# Altium schematic sheet Motor-E2.SchDoc: Motor-E2
size Letter; DocumentNumber: 3; SheetNumber: 9; SheetTotal: 11
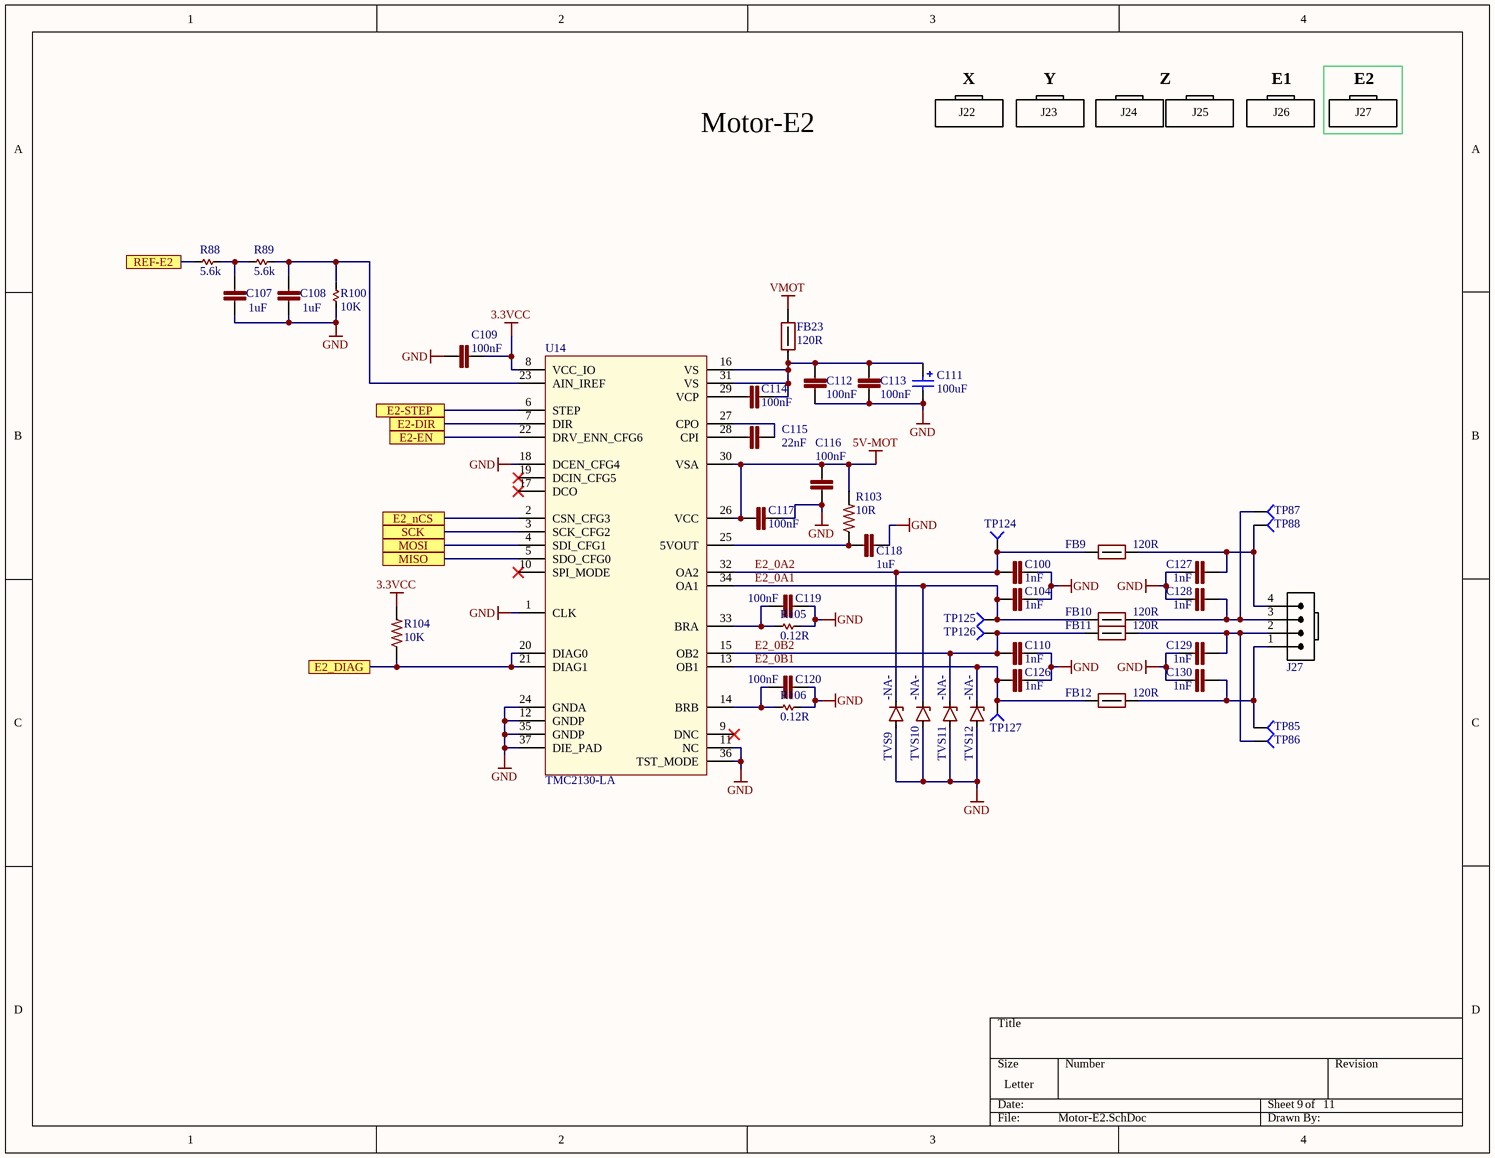
[diagram p0: Motor-E2.SchDoc]

## Parts
C100  1nF  [C0402]
C104  1nF  [C0402]
C107  1uF  [C0402]
C108  1uF  [C0402]
C109  100nF  [C0402]
C110  1nF  [C0402]
C111  value 100uF  [CAP-ELEC-063063077]  (hidden comment: UWT1V101MCL1GS)
C112  100nF  [C0603]
C113  100nF  [C0603]
C114  100nF  [C0603]
C115  22nF  [C0402]
C116  100nF  [C0402]
C117  100nF  [C0402]
C118  1uF  [C0402]
C119  100nF  [C0603]
C120  100nF  [C0603]
C126  1nF  [C0402]
C127  1nF  [C0402]
C128  1nF  [C0402]
C129  1nF  [C0402]
C130  1nF  [C0402]
FB9  120R  [FB0603]
FB10  120R  [FB0603]
FB11  120R  [FB0603]
FB12  120R  [FB0603]
FB23  120R  [FB0603]
J27  Molex 0705430038  [4POL254 PIN-IN-PASTE]  (value not drawn)
R88  5.6k  [R0402]
R89  5.6k  [R0402]
R100  10K  [R0402]
R103  10R  [R0402]
R104  10K  [R0402]
R105  0.12R  [R1206]
R106  0.12R  [R1206]
TP85  TP4  [TP-2]  (value not drawn)  (no BOM)
TP86  TP4  [TP-2]  (value not drawn)  (no BOM)
TP87  TP4  [TP-2]  (value not drawn)  (no BOM)
TP88  TP4  [TP-2]  (value not drawn)  (no BOM)
TP124  TP4  [TP-2]  (value not drawn)  (no BOM)
TP125  TP4  [TP-2]  (value not drawn)  (no BOM)
TP126  TP4  [TP-2]  (value not drawn)  (no BOM)
TP127  TP4  [TP-2]  (value not drawn)  (no BOM)
TVS9  value -NA-  [SMF]  (hidden comment: TVS 30V SMF)
TVS10  value -NA-  [SMF]  (hidden comment: TVS 30V SMF)
TVS11  value -NA-  [SMF]  (hidden comment: TVS 30V SMF)
TVS12  value -NA-  [SMF]  (hidden comment: TVS 30V SMF)
U14  TMC2130-LA  [QFN36-50P500X600X900_HS-37N]

## Ports
E2-DIR, E2-EN, E2-STEP, E2_DIAG, E2_nCS, MISO, MOSI, REF-E2, SCK

## Nets
3.3VCC: C109.1 R104.2 U14.8(VCC_IO)
5V-MOT: C116.2 C117.2 R103.2 U14.26(VCC) U14.30(VSA)
GND: C100.2 C104.2 C107.2 C108.2 C109.2 C110.2 C111.2 C112.1 C113.1 C116.1 C117.1 C118.2 C119.1 C120.1 C126.2 C127.1 C128.1 C129.1 C130.1 R100.1 R105.2 R106.2 TVS9.A TVS10.A TVS11.A TVS12.A U14.1(CLK) U14.11(NC) U14.12(GNDP) U14.18(DCEN_CFG4) U14.24(GNDA) U14.35(GNDP) U14.36(TST_MODE) U14.37(DIE_PAD)
VMOT: FB23.2
E2-DIR: U14.7(DIR) ; port E2-DIR
E2-EN: U14.22(DRV_ENN_CFG6) ; port E2-EN
E2-STEP: U14.6(STEP) ; port E2-STEP
E2_0A1: C104.1 FB10.1 TP125.1 TVS10.K U14.34(OA1)
E2_0A2: C100.1 FB9.1 TP124.1 TVS9.K U14.32(OA2)
E2_0B1: C126.1 FB12.1 TP127.1 TVS12.K U14.13(OB1)
E2_0B2: C110.1 FB11.1 TP126.1 TVS11.K U14.15(OB2)
E2_DIAG: R104.1 U14.20(DIAG0) U14.21(DIAG1) ; port E2_DIAG
E2_nCS: U14.2(CSN_CFG3) ; port E2_nCS
MISO: U14.5(SDO_CFG0) ; port MISO
MOSI: U14.4(SDI_CFG1) ; port MOSI
REF-E2: R88.1 ; port REF-E2
SCK: U14.3(SCK_CFG2) ; port SCK
NetC107_1: C107.1 R88.2 R89.1
NetC108_1: C108.1 R89.2 R100.2 U14.23(AIN_IREF)
NetC111_1: C111.1 C112.2 C113.2 C114.2 FB23.1 U14.16(VS) U14.31(VS)
NetC114_1: C114.1 U14.29(VCP)
NetC115_1: C115.1 U14.28(CPI)
NetC115_2: C115.2 U14.27(CPO)
NetC118_1: C118.1 R103.1 U14.25(5VOUT)
NetC119_2: C119.2 R105.1 U14.33(BRA)
NetC120_2: C120.2 R106.1 U14.14(BRB)
NetC127_2: C127.2 FB9.2 J27.4 TP88.1
NetC128_2: C128.2 FB10.2 J27.3 TP87.1
NetC129_2: C129.2 FB11.2 J27.2 TP86.1
NetC130_2: C130.2 FB12.2 J27.1 TP85.1

Not connected (* = marked no-connect by the designer): U14 9(DNC)* 10(SPI_MODE)* 17(DCO)* 19(DCIN_CFG5)*

## Notes on the sheet
- X
- Y
- Z
- E1
- E2
- Motor-E2
- J22
- J23
- J24
- J25
- J26
- J27

## Library data of the parts
C100 C104 C110 C126-C130 = CAP 1nF 50V 0402 X7R: 1000pF 50V Ceramic Capacitor X7R 0402 (1005 Metric) 0.039" L x 0.020" W (1.00mm x 0.50mm); MANUFACTURER: Murata; MANUFACTURER #: GRM155R71H102KA01D; PART: 1nF 50V X7R 0402; PART DESCRIPTION: 1000pF ±10% 50V Ceramic Capacitor X7R 0402 (1005 Metric); TOLERANCE: 10%; VALUE: 1nF; DISTRIBUTOR #: 490-1303-2-ND; DISTRIBUTOR: Digi-Key Electronics; EE_SPEC: 50V
C107 C108 = GRM155R60J105KE19D: CAP CER 0402 1uF 6.3V 10% X5R; MANUFACTURER: Murata; PART: 1uF 6.3V X5R 0402; PART DESCRIPTION: 1µF ±10% 6.3V Ceramic Capacitor X5R 0402 (1005 Metric); VALUE: 1uF; MANUFACTURER #: GRM155R60J105KE19D; DISTRIBUTOR #: 490-1320-2-ND; DISTRIBUTOR: Digi-Key Electronics; TOLERANCE: 10%; EE_SPEC: 1uF 6.3V X5R 0402
C109 C116 C117 = GRM155R71C104KA88D: CAP CER 0402 100nF 16V 10% X7R; Manufacturer: Murata; PART: 0.1uF 16V X7R 0402; Part Description: 0.10µF ±10% 16V Ceramic Capacitor X7R 0402 (1005 Metric); EE_SPEC: 100nF 16V X7R 0402; VALUE: 100nF; MANUFACTURER #: GRM155R71C104KA88D; DISTRIBUTOR #: 490-3261-2-ND; DISTRIBUTOR: Digi-Key Electronics; Tolerance: 10%
C111 = UWT1V101MCL1GS: CAP ALUM 100UF 35V 20% SMD; Manufacturer: Nichicon; PART: 100uF 35V SMD Al-El; Part Description: 100µF 35V Aluminum Capacitors Radial, Can - SMD 1000 Hrs @ 105°C; EE_SPEC: 100uF 35V Al-El; MANUFACTURER #: UWT1V101MCL1GS; DISTRIBUTOR #: 493-2203-2-ND; DISTRIBUTOR: Digi-Key Electronics; Tolerance: 20%
C112-C114 C119 C120 = C0603C104K5RACTU: CAP CER 0603 100nF 50V 10% X7R; Manufacturer: Kemet; Part Description: 0.1µF ±10% 50V Ceramic Capacitor X7R 0603 (1608 Metric); EE_SPEC: 100nF 50V X7R 0603; VALUE: 100nF; MANUFACTURER #: C0603C104K5RACTU; DISTRIBUTOR #: 399-5089-2-ND; DISTRIBUTOR: Digi-Key Electronics; PART: 100nF 50V X7R 0603; Tolerance: 10%
C115 = GCM155R71H223KA55D: CAP CER 0402 22nF ±10% 50V X7R; Manufacturer: YAGEO; Part Description: 0.022µF ±10% 50V Ceramic Capacitor X7R 0402 (1005 Metric); EE_SPEC: 22nF 50V X7R 0402; Tolerance: +/- 10%; VALUE: 22nF; MANUFACTURER #: GCM155R71H223KA55D; DISTRIBUTOR #: 490-4763-2-ND; DISTRIBUTOR: Digi-Key Electronics; PART: 22nF
C118 = GRM155R60J105KE19D: CAP CER 0402 1uF 6.3V 10% X5R; Manufacturer: Murata; Part Description: 1µF ±10% 6.3V Ceramic Capacitor X5R 0402 (1005 Metric); EE_SPEC: 1uF 6.3V X5R 0402; VALUE: 1uF; MANUFACTURER #: GRM155R60J105KE19D; DISTRIBUTOR #: 490-1320-2-ND; DISTRIBUTOR: Digi-Key Electronics; PART: 1uF 6.3V X5R 0402; Tolerance: 10%
FB9-FB12 = FERRITE 120R 3A 0603: FERRITE BEAD 120 OHM 0603 1LN; MANUFACTURER: Samsung; MANUFACTURER #: CIS10P121AC; MANUFACTURER2#: 490-5254-2-ND; VALUE: 120Rfb; TOLERANCE: -NA-; EE_SPEC: 3A; DISTRIBUTOR #: 1276-6351-2-ND; DISTRIBUTOR: Digi-Key Electronics; PART: FERRITE 120R 3A 0603; PART DESCRIPTION: FERRITE BEAD 120 OHM 0603 1LN
FB23 = FERRITE 120R 3A 0603: FERRITE BEAD 120 OHM 0603 1LN; MANUFACTURER: Samsung; MANUFACTURER #: CIS10P121AC; VALUE: 120Rfb; TOLERANCE: -NA-; EE_SPEC: 3A; DISTRIBUTOR #: 1276-6351-2-ND; DISTRIBUTOR: Digi-Key Electronics; PART: FERRITE 120R 3A 0603; PART DESCRIPTION: FERRITE BEAD 120 OHM 0603 1LN
J27 = Molex 0705430003 PIP: Molex 4 Pin Clip Connector - Pin In Paste footprint
R88 R89 = 5.6k 1% 0402: RES SMD 5.6K OHM 1% 1/16W 0402; MANUFACTURER: YAGEO; MANUFACTURER #: RC0402FR-075K6L; PART DESCRIPTION: ±1% 0.063W, 1/16W Chip Resistor 0402 (1005 Metric) Moisture Resistant Thick Film; DISTRIBUTOR #: 311-5.6KLRTR-ND; DISTRIBUTOR: Digi-Key Electronics; PART: RES SMD 5.6K OHM 1% 1/16W 0402; TOLERANCE: 1%; EE_SPEC: 1/16W; VALUE: 5.6k
R100 = 10k 1% 0402: RES SMD 10K OHM 1% 1/16W 0402; MANUFACTURER: Yageo; MANUFACTURER #: RC0402FR-0710KP; PART DESCRIPTION: 10k Ohm ±1% 0.063W, 1/16W Chip Resistor 0402 (1005 Metric) Moisture Resistant Thick Film; DISTRIBUTOR #: YAG1249TR-ND; DISTRIBUTOR: Digi-Key Electronics; PART: 10k 1% 0402; TOLERANCE: 1%; EE_SPEC: 1/16W; VALUE: 10K
R103 = RC0402FR-0710RL: RES SMD 10 OHM 1% 1/16W 0402; Manufacturer: Yageo; Part Description: 10 Ohm ±1% 0.063W, 1/16W Chip Resistor 0402 (1005 Metric) Moisture Resistant Thick Film; EE_SPEC: 10R 1% 0402; VALUE: 10R; MANUFACTURER #: RC0402FR-0710RL; DISTRIBUTOR #: 311-10.0LRTR-ND; DISTRIBUTOR: Digi-Key Electronics; PART: 10R; Tolerance: 1%
R104 = RC0402FR-0710KP: RES SMD 10K OHM 1% 1/16W 0402; MANUFACTURER: Yageo; PART: 10k 1% 0402; PART DESCRIPTION: 10k Ohm ±1% 0.063W, 1/16W Chip Resistor 0402 (1005 Metric) Moisture Resistant Thick Film; VALUE: 10K; MANUFACTURER #: RC0402FR-0710KP; DISTRIBUTOR #: YAG1249TR-ND; DISTRIBUTOR: Digi-Key Electronics; TOLERANCE: 1%; EE_SPEC: 1/16W
R105 R106 = 0.12R 1% 1206: RES 0.12 OHM 1% 1/2W 1206; MANUFACTURER #: RL1206FR-7W0R12L; Part Description: 120 mOhms ±1% 0.5W, 1/2W Chip Resistor 1206 (3216 Metric) Automotive AEC-Q200, Current Sense, Moisture Resistant Thick Film; Tolerance: +/- 1%; DISTRIBUTOR #: 311-.12LYTR-ND; DISTRIBUTOR: Digi-Key; EE_SPEC: 0.12R 1% 1206; PART: 0.12R; VALUE: 0.12R
TP85-TP88 TP124-TP127 = Socket: MANUFACTURER #: NOTAPART-Testpoint
TVS9-TVS12 = TVS 30V SMF: TVS DIODE 30VWM 48.4VC SMF; MANUFACTURER: Vishay; MANUFACTURER #: SMF30A-E3-08; PART: TVS Diode 48.4VC; EE_SPEC: 30Vrs 48.4Vc; DISTRIBUTOR #: SMF30A-E3-08GITR-ND; DISTRIBUTOR: Digi-Key Electronics; PART DESCRIPTION: TVS DIODE 30VWM 48.4VC SMF; TOLERANCE: -NA-
U14 = TMC2130-LA-T: IC STEPPER MOTOR DVR SPI 36QFN; Manufacturer: Trinamic; Part Description: Bipolar Motor Driver Power MOSFET SPI, Step/Direction 36-QFN (5x6); EE_SPEC: 46V 1.2A 1/256 Step; Tolerance: NA; DISTRIBUTOR #: 1460-1130-2-ND; DISTRIBUTOR: Digi-Key Electronics; MANUFACTURER #: TMC2130-LA-T; PART: TMC2130; VALUE: TMC2130